# Altium schematic sheet POE.SchDoc: {Наименование}
size 420 x 297 mm; ApprovedBy: {Утвердил}; CheckedBy: {Проверил}; DrawnBy: {Разраб.}; DocumentNumber: АБВГ 123456.789 00; SheetNumber: 12; SheetTotal: {}; Scale: {Мш.}; PageSetup: Record=PageOptions|CenterHorizontal=False|CenterVertical=False|PrintScale=0.95|XCorrection=0.00|YCorrection=0.00|PrintKind=1|BorderSize=5000000|LeftOffset=0|BottomOffset=0|Orientation=1|PaperLength=1000|PaperWidth=1000|Scale=100|PaperSource=15|PrintQuality=600|MediaType=1|DitherType=10|PaperKind=A4|PrintScaleMode=1; ProcessInspection: {Т.контр.}; Mass: {М.}; NormInspection: {Н.контр.}; Letter1Column: {}; Letter2Column: {}; Letter3Column: {}; DocumentType: {Документ}; Rule: PcbType=ProtelPcb
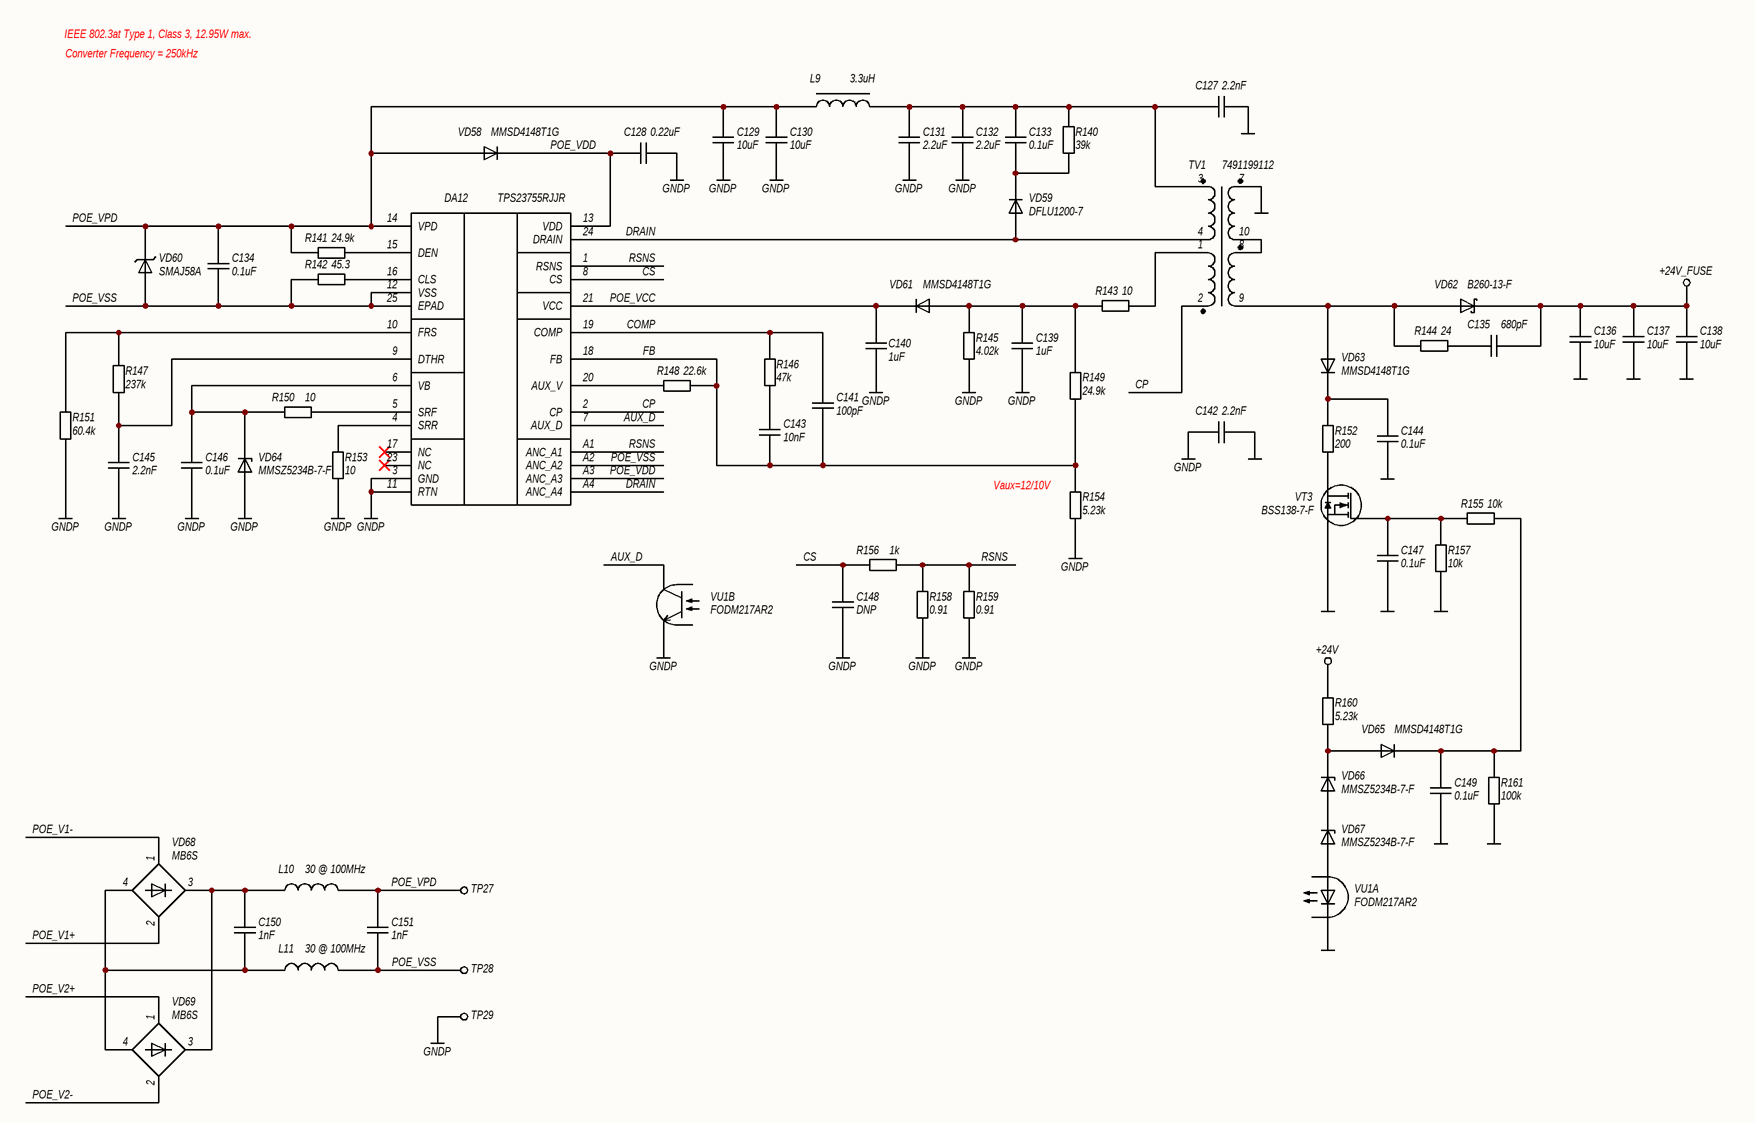
[diagram p0: POE.SchDoc]

## Parts
C127  2.2nF  [C1812N]
C128  0.22uF  [C0805N]
C129  10uF  [C1210N]
C130  10uF  [C1210N]
C131  2.2uF  [C1210N]
C132  2.2uF  [C1210N]
C133  0.1uF  [C0805N]
C134  0.1uF  [C0805N]
C135  680pF  [C0805N]
C136  10uF  [C1206N]
C137  10uF  [C1206N]
C138  10uF  [C1206N]
C139  1uF  [C0805N]
C140  1uF  [C0805N]
C141  100pF  [C0603N]
C142  2.2nF  [C1812N]
C143  10nF  [C0603N]
C144  0.1uF  [C0603N]
C145  2.2nF  [C0603N]
C146  0.1uF  [C0603N]
C147  0.1uF  [C0603N]
C148  DNP  [C0603N]  (no BOM)
C149  0.1uF  [C0603N]
C150  1nF  [C0603N]
C151  1nF  [C0603N]
DA12  TPS23755RJJR  [RJJ0023B (VSON-24 EP)]
L9  3.3uH  [SRN3015]
L10  30 @ 100MHz  [FB0603N]
L11  30 @ 100MHz  [FB0603N]
R140  39k  [R0805N]
R141  24.9k  [R0603N]
R142  45.3  [R0603N]
R143  10  [R0805N]
R144  24  [R1206N]
R145  4.02k  [R0603N]
R146  47k  [R0603N]
R147  237k  [R0603N]
R148  22.6k  [R0603N]
R149  24.9k  [R0603N]
R150  10  [R0603N]
R151  60.4k  [R0603N]
R152  200  [R2512N]
R153  10  [R0603N]
R154  5.23k  [R0603N]
R155  10k  [R0603N]
R156  1k  [R0603N]
R157  10k  [R0603N]
R158  0.91  [R1206N]
R159  0.91  [R1206N]
R160  5.23k  [R0603N]
R161  100k  [R0603N]
TP27  TEST_POINT  [TP_RPAD_0.8MM]  (value not drawn)  (no BOM)
TP28  TEST_POINT  [TP_RPAD_0.8MM]  (value not drawn)  (no BOM)
TP29  TEST_POINT  [TP_RPAD_0.8MM]  (value not drawn)  (no BOM)
TV1  7491199112  [7491199112]
VD58  MMSD4148T1G  [SOD123]
VD59  DFLU1200-7  [PowerDI123]
VD60  SMAJ58A  [SMA]
VD61  MMSD4148T1G  [SOD123]
VD62  B260-13-F  [SMB]
VD63  MMSD4148T1G  [SOD123]
VD64  MMSZ5234B-7-F  [SOD123]
VD65  MMSD4148T1G  [SOD123]
VD66  MMSZ5234B-7-F  [SOD123]
VD67  MMSZ5234B-7-F  [SOD123]
VD68  MB6S  [MBS (TO-269AA)]
VD69  MB6S  [MBS (TO-269AA)]
VT3  BSS138-7-F  [SOT23]
VU1  FODM217AR2  [MFP4 2.5x4.4]  (parts A,B of 2)

## Nets
+24V: R160.2
+24V_FUSE: C135.2 C136.2 C137.2 C138.2 VD62.1(K)
GND: C127.2 C136.1 C137.1 C138.1 C142.2 C144.2 C147.1 C149.1 R157.2 R161.2 TV1.7 VT3.2(S) VU1.2(K)
GNDP: C128.1 C129.1 C130.1 C131.1 C132.1 C139.1 C140.1 C142.1 C145.1 C146.2 C148.2 DA12.3(GND) DA12.11(RTN) R145.1 R151.1 R153.1 R154.1 R158.1 R159.1 TP29.1 VD64.2(A) VU1.3(E)
AUX_D: DA12.7(AUX_D) VU1.4(C)
COMP: C141.1 DA12.19(COMP) R146.1
CP: DA12.2(CP) TV1.2
CS: C148.1 DA12.8(CS) R156.2
DRAIN: DA12.24(DRAIN) DA12.A4(ANC_A4) TV1.4 VD59.2(A)
FB: C141.2 C143.2 DA12.18(FB) R148.1 R149.1 R154.2
POE_V1+: VD68.2(AC)
POE_V1-: VD68.1(AC)
POE_V2+: VD69.1(AC)
POE_V2-: VD69.2(AC)
POE_VCC: C140.2 DA12.21(VCC) VD61.1(K)
POE_VDD: C128.2 DA12.13(VDD) DA12.A3(ANC_A3) VD58.1(K)
POE_VPD: C129.2 C130.2 C134.2 C151.1 DA12.14(VPD) L9.1 L10.2 R141.1 TP27.1 VD58.2(A) VD60.1(K)
POE_VSS: C134.1 C151.2 DA12.12(VSS) DA12.25(EPAD) DA12.A2(ANC_A2) L11.2 R142.1 TP28.1 VD60.2(A)
RSNS: DA12.1(RSNS) DA12.A1(ANC_A1) R156.1 R158.2 R159.2
NetC127_1: C127.1 C131.2 C132.2 C133.2 L9.2 R140.2 TV1.3
NetC133_1: C133.1 R140.1 VD59.1(K)
NetC135_1: C135.1 R144.1
NetC139_2: C139.2 R143.1 R145.2 R149.2 VD61.2(A)
NetC143_1: C143.1 R146.2
NetC144_1: C144.1 R152.2 VD63.1(K)
NetC145_2: C145.2 DA12.9(DTHR) R147.2
NetC146_1: C146.1 DA12.6(VB) R150.1 VD64.1(K)
NetC147_2: C147.2 R155.1 R157.1 VT3.1(G)
NetC149_2: C149.2 R155.2 R161.1 VD65.1(K)
NetC150_1: C150.1 L10.1 VD68.3(+) VD69.3(+)
NetC150_2: C150.2 L11.1 VD68.4(-) VD69.4(-)
NetDA12_4: DA12.4(SRR) R153.2
NetDA12_5: DA12.5(SRF) R150.2
NetDA12_10: DA12.10(FRS) R147.1 R151.2
NetDA12_15: DA12.15(DEN) R141.2
NetDA12_16: DA12.16(CLS) R142.2
NetDA12_20: DA12.20(AUX_V) R148.2
NetR143_2: R143.2 TV1.1
NetR144_2: R144.2 TV1.9 VD62.2(A) VD63.2(A)
NetR152_1: R152.1 VT3.3(D)
NetR160_1: R160.1 VD65.2(A) VD66.1(K)
NetTV1_8: TV1.8 TV1.10
NetVD66_2: VD66.2(A) VD67.1(K)
NetVD67_2: VD67.2(A) VU1.1(A)

Not connected (* = marked no-connect by the designer): DA12 17(NC)* 23(NC)*

## Notes on the sheet
- IEEE 802.3at Type 1, Class 3, 12.95W max.
- Converter Frequency = 250kHz
- (near R154) Vaux=12/10V
- Подп. и дата
- Инв. № дубл.
- Взам. инв. №
- Инв. № подл.
- Лист
- Изм.
- № докум.
- Подп.
- Дата
- Копировал
- Формат А3

## Library data of the parts
C127 C142 = GR443QR73D222KW01L: Конденсатор; Точность: 10%; Напряжение: 2kV; Диэлектрик: X7R; Производитель: Murata Electronics; Описание: 2200 pF ±10% 2000V (2kV) Ceramic Capacitor X7R 1812 (4532 Metric); Корпус: 1812 (4532 Metric); Температурный диапазон: -55°C ~ 125°C; Вид монтажа: SMD; Артикул: GR443QR73D222KW01L; Номинал: 2.2nF; Строка для документации: https://search.murata.co.jp/Ceramy/image/img/A01X/G101/ENG/GR443QR73D222KW01-01.pdf; Тип элемента: Конденсатор
C128 = CC0805KKX7R0BB224: Конденсатор; Точность: 10%; Напряжение: 100V; Диэлектрик: X7R; Производитель: YAGEO; Описание: 0.22 µF ±10% 100V Ceramic Capacitor X7R 0805 (2012 Metric); Корпус: 0805 (2012 Metric); Температурный диапазон: -55°C ~ 125°C; Вид монтажа: SMD; Артикул: CC0805KKX7R0BB224; Номинал: 0.22uF; Строка для документации: https://www.yageo.com/upload/media/product/app/datasheet/mlcc/upy-np0x7r_mv_100-to-630v.pdf; Тип элемента: Конденсатор
C129 C130 = GRM32EC72A106KE05L: Конденсатор; Точность: 10%; Напряжение: 100V; Диэлектрик: X7S; Производитель: Murata Electronics; Описание: 10 µF ±10% 100V Ceramic Capacitor X7S 1210 (3225 Metric); Корпус: 1210 (3225 Metric); Температурный диапазон: -55°C ~ 125°C; Вид монтажа: SMD; Артикул: GRM32EC72A106KE05L; Номинал: 10uF; Строка для документации: https://www.samsungsem.com/resources/file/global/support/product_catalog/MLCC.pdf; Тип элемента: Конденсатор
C131 C132 = CL32B225KCJSNNE: Конденсатор; Точность: 10%; Напряжение: 100V; Диэлектрик: X7R; Производитель: Samsung Electro-Mechanics; Описание: 2.2 µF ±10% 100V Ceramic Capacitor X7R 1210 (3225 Metric); Корпус: 1210 (3225 Metric); Температурный диапазон: -55°C ~ 125°C; Вид монтажа: SMD; Артикул: CL32B225KCJSNNE; Номинал: 2.2uF; Строка для документации: https://mm.digikey.com/Volume0/opasdata/d220001/medias/docus/41/CL32B225KCJSNNE_Spec.pdf; Тип элемента: Конденсатор
C133 C134 = CL21B104KCFNNNE: Конденсатор; Точность: 10%; Напряжение: 100V; Диэлектрик: X7R; Производитель: Samsung Electro-Mechanics; Описание: 0.1 µF ±10% 100V Ceramic Capacitor X7R 0805 (2012 Metric); Корпус: 0805 (2012 Metric); Температурный диапазон: -55°C ~ 125°C; Вид монтажа: SMD; Артикул: CL21B104KCFNNNE; Номинал: 0.1uF; Строка для документации: https://mm.digikey.com/Volume0/opasdata/d220001/medias/docus/893/CL21B104KCFNNNE_Spec.pdf; Тип элемента: Конденсатор
C135 = CC0805KRX7R0BB681: Конденсатор; Точность: 10%; Напряжение: 100V; Диэлектрик: X7R; Производитель: YAGEO; Описание: 680 pF ±10% 100V Ceramic Capacitor X7R 0805 (2012 Metric); Корпус: 0805 (2012 Metric); Температурный диапазон: -55°C ~ 125°C; Вид монтажа: SMD; Артикул: CC0805KRX7R0BB681; Номинал: 680pF; Строка для документации: https://www.yageo.com/upload/media/product/app/datasheet/mlcc/upy-np0x7r_mv_100-to-630v.pdf; Тип элемента: Конденсатор
C136-C138 = CL31B106KBHNNNE: Конденсатор; Точность: 10%; Напряжение: 50V; Диэлектрик: X7R; Производитель: Samsung Electro-Mechanics; Описание: 10 µF ±10% 50V Ceramic Capacitor X7R 1206 (3216 Metric); Корпус: 1206 (3216 Metric); Температурный диапазон: -55°C ~ 125°C; Вид монтажа: SMD; Артикул: CL31B106KBHNNNE; Номинал: 10uF; Строка для документации: https://mm.digikey.com/Volume0/opasdata/d220001/medias/docus/41/CL31B106KBHNNNE_Spec.pdf; Тип элемента: Конденсатор
C139 C140 = CL21B105KAFNNNE: Конденсатор; Точность: 10%; Напряжение: 25V; Диэлектрик: X7R; Производитель: Samsung Electro-Mechanics; Описание: 1 µF ±10% 25V Ceramic Capacitor X7R 0805 (2012 Metric); Корпус: 0805 (2012 Metric); Температурный диапазон: -55°C ~ 125°C; Вид монтажа: SMD; Артикул: CL21B105KAFNNNE; Номинал: 1uF; Строка для документации: https://mm.digikey.com/Volume0/opasdata/d220001/medias/docus/1105/CL21B105KAFNNNE_Spec.pdf; Тип элемента: Конденсатор
C141 = CL10C101JB8NNNC: Конденсатор; Точность: 5%; Напряжение: 50V; Диэлектрик: NP0; Производитель: Samsung Electro-Mechanics; Описание: 100 pF ±5% 50V Ceramic Capacitor C0G, NP0 0603 (1608 Metric); Корпус: 0603 (1608 Metric); Температурный диапазон: -55°C ~ 125°C; Вид монтажа: SMD; Артикул: CL10C101JB8NNNC; Номинал: 100pF; Строка для документации: https://mm.digikey.com/Volume0/opasdata/d220001/medias/docus/609/CL10C101JB8NNNC_Spec.pdf; Тип элемента: Конденсатор
C143 = CL10B103KB8NNNC: Конденсатор; Точность: 10%; Напряжение: 16V; Диэлектрик: X7R; Производитель: Samsung Electro-Mechanics; Описание: 10000 pF ±10% 50V Ceramic Capacitor X7R 0603 (1608 Metric); Корпус: 0603 (1608 Metric); Температурный диапазон: -55°C ~ 125°C; Вид монтажа: SMD; Артикул: CL10B103KB8NNNC; Номинал: 10nF; Строка для документации: https://mm.digikey.com/Volume0/opasdata/d220001/medias/docus/609/CL10B103KB8NNNC_Spec.pdf; Тип элемента: Конденсатор
C144 C146 C147 C149 = CL10B104KB8NNNC: Конденсатор; Точность: 10%; Напряжение: 50V; Диэлектрик: X7R; Производитель: Samsung Electro-Mechanics; Описание: 0.1 µF ±10% 50V Ceramic Capacitor X7R 0603 (1608 Metric); Корпус: 0603 (1608 Metric); Температурный диапазон: -55°C ~ 125°C; Вид монтажа: SMD; Артикул: CL10B104KB8NNNC; Номинал: 0.1uF; Строка для документации: https://mm.digikey.com/Volume0/opasdata/d220001/medias/docus/609/CL10B104KB8NNNC_Spec.pdf; Тип элемента: Конденсатор
C145 = CL10B222KB8NNNC: Конденсатор; Точность: 10%; Напряжение: 50V; Диэлектрик: X7R; Производитель: Samsung Electro-Mechanics; Описание: 2200 pF ±10% 50V Ceramic Capacitor X7R 0603 (1608 Metric); Корпус: 0603 (1608 Metric); Температурный диапазон: -55°C ~ 125°C; Вид монтажа: SMD; Артикул: CL10B222KB8NNNC; Номинал: 2.2nF; Строка для документации: https://mm.digikey.com/Volume0/opasdata/d220001/medias/docus/1832/CL10B222KB8NNNC_Spec.pdf; Тип элемента: Конденсатор
C148 = CC0603CRNPO9BN6R8: Конденсатор; Корпус: 0603 (1608 Metric); Вид монтажа: SMD; Артикул: *; Номинал: DNP; Точность: *; Напряжение: *; Диэлектрик: *; Производитель: *; Описание: *; Строка для документации: *; Температурный диапазон: *; Тип элемента: Конденсатор
C150 C151 = CL10B102KC8NNNC: Конденсатор; Точность: 10%; Напряжение: 100V; Диэлектрик: X7R; Производитель: Samsung Electro-Mechanics; Описание: 1000 pF ±10% 100V Ceramic Capacitor X7R 0603 (1608 Metric); Корпус: 0603 (1608 Metric); Температурный диапазон: -55°C ~ 125°C; Вид монтажа: SMD; Артикул: CL10B102KC8NNNC; Номинал: 1nF; Строка для документации: https://mm.digikey.com/Volume0/opasdata/d220001/medias/docus/1136/CL10B102KC8NNNC_Spec.pdf; Тип элемента: Конденсатор
DA12 = TPS23755RJJR: Микросхема PoE 802.3at DC-DC контроллера; Производитель: Texas Instruments; Описание: Power Over Ethernet Controller 1 Channel 802.3at (PoE) 24-VSON (6x4); Корпус: 24-VFDFN Exposed Pad, 23 Leads; Температурный диапазон: -40°C ~ 125°C (TJ); Вид монтажа: SMD; Артикул: TPS23755RJJR; Строка для документации: https://www.ti.com/lit/ds/symlink/tps23755.pdf; Тип элемента: Микросхема
L9 = SRN3015-3R3M: Дроссель с магнитопроводом; Точность: 20%; Ток номинальный: 1.6A; Ток насыщения: 1.4A; Сопротивление: 112m; Производитель: Bourns Inc.; Описание: 3.3 µH Semi-Shielded Drum Core, Wirewound Inductor 1.6 A 112mOhm Max Nonstandard; Корпус: 3.00mm x 3.00mm; Температурный диапазон: -40°C ~ 125°C; Вид монтажа: SMD; Артикул: SRN3015-3R3M; Номинал: 3.3uH; Строка для документации: https://www.bourns.com/docs/Product-Datasheets/SRN3015.pdf; Тип элемента: Дроссель
L10 L11 = BLM18PG300SN1D: Фильтр ЭМП индуктивный; Ток: 1A; Сопротивление: 50m; Тип: Ferrite Bead; Производитель: Murata Electronics; Описание: 30 Ohms @ 100 MHz 1 Power Line Ferrite Bead 0603 (1608 Metric) 1A 50mOhm; Корпус: 0603 (1608 Metric); Температурный диапазон: -55°C ~ 125°C; Вид монтажа: SMD; Артикул: BLM18PG300SN1D; Номинал: 30 @ 100MHz; Строка для документации: https://www.murata.com/en-us/products/productdata/8796738650142/ENFA0003.pdf; Тип элемента: Фильтр ЭМП
R140 = RC0805JR-0739KL: Резистор; Точность: 5%; ТКС: ±100ppm/°C; Напряжение: 150V; Производитель: YAGEO; Описание: 39 kOhms ±5% 0.125W, 1/8W Chip Resistor 0805 (2012 Metric) Moisture Resistant Thick Film; Корпус: 0805 (2012 Metric); Температурный диапазон: -55°C ~ 155°C; Вид монтажа: SMD; Артикул: RC0805JR-0739KL; Номинал: 39k; Строка для документации: https://www.yageo.com/upload/media/product/productsearch/datasheet/rchip/PYu-RC_Group_51_RoHS_L_12.pdf; Тип элемента: Резистор
R141 R149 = RC0603FR-0724K9L: Резистор; Точность: 1%; ТКС: ±100ppm/°C; Напряжение: 75V; Производитель: YAGEO; Описание: 24.9 kOhms ±1% 0.1W, 1/10W Chip Resistor 0603 (1608 Metric) Moisture Resistant Thick Film; Корпус: 0603 (1608 Metric); Температурный диапазон: -55°C ~ 155°C; Вид монтажа: SMD; Артикул: RC0603FR-0724K9L; Номинал: 24.9k; Строка для документации: https://www.yageo.com/upload/media/product/app/datasheet/rchip/pyu-rc_group_51_rohs_l.pdf; Тип элемента: Резистор
R142 = RC0603FR-0745R3L: Резистор; Точность: 1%; ТКС: ±100ppm/°C; Напряжение: 75V; Производитель: YAGEO; Описание: 45.3 Ohms ±1% 0.1W, 1/10W Chip Resistor 0603 (1608 Metric) Moisture Resistant Thick Film; Корпус: 0603 (1608 Metric); Температурный диапазон: -55°C ~ 155°C; Вид монтажа: SMD; Артикул: RC0603FR-0745R3L; Номинал: 45.3; Строка для документации: https://www.yageo.com/upload/media/product/app/datasheet/rchip/pyu-rc_group_51_rohs_l.pdf; Тип элемента: Резистор
R143 = RC0805FR-0710RL: Резистор; Точность: 1%; ТКС: ±100ppm/°C; Напряжение: 150V; Производитель: YAGEO; Описание: 10 Ohms ±1% 0.125W, 1/8W Chip Resistor 0805 (2012 Metric) Moisture Resistant Thick Film; Корпус: 0805 (2012 Metric); Температурный диапазон: -55°C ~ 155°C; Вид монтажа: SMD; Артикул: RC0805FR-0710RL; Номинал: 10; Строка для документации: https://www.yageo.com/upload/media/product/productsearch/datasheet/rchip/PYu-RC_Group_51_RoHS_L_12.pdf; Тип элемента: Резистор
R144 = RC1206JR-0724RL: Резистор; Точность: 5%; ТКС: ±100ppm/°C; Напряжение: 75V; Производитель: YAGEO; Описание: 24 Ohms ±5% 0.1W, 1/10W Chip Resistor 0603 (1608 Metric) Moisture Resistant Thick Film; Корпус: 1206 (3216 Metric); Температурный диапазон: -55°C ~ 155°C; Вид монтажа: SMD; Артикул: RC1206JR-0724RL; Номинал: 24; Строка для документации: https://www.yageo.com/upload/media/product/productsearch/datasheet/rchip/PYu-RC_Group_51_RoHS_L_12.pdf; Тип элемента: Резистор
R145 = RC0603FR-074K02L: Резистор; Точность: 1%; ТКС: ±100ppm/°C; Напряжение: 75V; Производитель: YAGEO; Описание: 4.02 kOhms ±1% 0.1W, 1/10W Chip Resistor 0603 (1608 Metric) Moisture Resistant Thick Film; Корпус: 0603 (1608 Metric); Температурный диапазон: -55°C ~ 155°C; Вид монтажа: SMD; Артикул: RC0603FR-074K02L; Номинал: 4.02k; Строка для документации: https://www.yageo.com/upload/media/product/app/datasheet/rchip/pyu-rc_group_51_rohs_l.pdf; Тип элемента: Резистор
R146 = RC0603FR-0747KL: Резистор; Точность: 1%; ТКС: ±100ppm/°C; Напряжение: 75V; Производитель: YAGEO; Описание: 47 kOhms ±1% 0.1W, 1/10W Chip Resistor 0603 (1608 Metric) Moisture Resistant Thick Film; Корпус: 0603 (1608 Metric); Температурный диапазон: -55°C ~ 155°C; Вид монтажа: SMD; Артикул: RC0603FR-0747KL; Номинал: 47k; Строка для документации: https://www.yageo.com/upload/media/product/app/datasheet/rchip/pyu-rc_group_51_rohs_l.pdf; Тип элемента: Резистор
R147 = RC0603FR-07237KL: Резистор; Точность: 1%; ТКС: ±100ppm/°C; Напряжение: 75V; Производитель: YAGEO; Описание: 237 kOhms ±1% 0.1W, 1/10W Chip Resistor 0603 (1608 Metric) Moisture Resistant Thick Film; Корпус: 0603 (1608 Metric); Температурный диапазон: -55°C ~ 155°C; Вид монтажа: SMD; Артикул: RC0603FR-07237KL; Номинал: 237k; Строка для документации: https://www.yageo.com/upload/media/product/app/datasheet/rchip/pyu-rc_group_51_rohs_l.pdf; Тип элемента: Резистор
R148 = RC0603FR-0722K6L: Резистор; Точность: 1%; ТКС: ±100ppm/°C; Напряжение: 75V; Производитель: YAGEO; Описание: 22.6 kOhms ±1% 0.1W, 1/10W Chip Resistor 0603 (1608 Metric) Moisture Resistant Thick Film; Корпус: 0603 (1608 Metric); Температурный диапазон: -55°C ~ 155°C; Вид монтажа: SMD; Артикул: RC0603FR-0722K6L; Номинал: 22.6k; Строка для документации: https://www.yageo.com/upload/media/product/app/datasheet/rchip/pyu-rc_group_51_rohs_l.pdf; Тип элемента: Резистор
R150 R153 = RC0603FR-0710RL: Резистор; Точность: 1%; ТКС: ±100ppm/°C; Напряжение: 75V; Производитель: YAGEO; Описание: 10 Ohms ±1% 0.1W, 1/10W Chip Resistor 0603 (1608 Metric) Moisture Resistant Thick Film; Корпус: 0603 (1608 Metric); Температурный диапазон: -55°C ~ 155°C; Вид монтажа: SMD; Артикул: RC0603FR-0710RL; Номинал: 10; Строка для документации: https://www.yageo.com/upload/media/product/app/datasheet/rchip/pyu-rc_group_51_rohs_l.pdf; Тип элемента: Резистор
R151 = RC0603FR-0760K4L: Резистор; Точность: 1%; ТКС: ±100ppm/°C; Напряжение: 75V; Производитель: YAGEO; Описание: 60.4 kOhms ±1% 0.1W, 1/10W Chip Resistor 0603 (1608 Metric) Moisture Resistant Thick Film; Корпус: 0603 (1608 Metric); Температурный диапазон: -55°C ~ 155°C; Вид монтажа: SMD; Артикул: RC0603FR-0760K4L; Номинал: 60.4k; Строка для документации: https://www.yageo.com/upload/media/product/app/datasheet/rchip/pyu-rc_group_51_rohs_l.pdf; Тип элемента: Резистор
R152 = CR2512-JW-201ELF: Резистор; Точность: 5%; ТКС: ±200ppm/°C; Напряжение: 200V; Производитель: Bourns Inc.; Описание: 200 Ohms ±5% 1W Chip Resistor 2512 (6432 Metric) Thick Film; Корпус: 2512 (6432 Metric); Температурный диапазон: -55°C ~ 155°C; Вид монтажа: SMD; Артикул: CR2512-JW-201ELF; Номинал: 200; Строка для документации: https://www.bourns.com/docs/product-datasheets/cr.pdf; Тип элемента: Резистор
R154 R160 = RC0603FR-075K23L: Резистор; Точность: 1%; ТКС: ±100ppm/°C; Напряжение: 75V; Производитель: YAGEO; Описание: 5.23 kOhms ±1% 0.1W, 1/10W Chip Resistor 0603 (1608 Metric) Moisture Resistant Thick Film; Корпус: 0603 (1608 Metric); Температурный диапазон: -55°C ~ 155°C; Вид монтажа: SMD; Артикул: RC0603FR-075K23L; Номинал: 5.23k; Строка для документации: https://www.yageo.com/upload/media/product/app/datasheet/rchip/pyu-rc_group_51_rohs_l.pdf; Тип элемента: Резистор
R155 R157 = RC0603FR-0710KL: Резистор; Точность: 1%; ТКС: ±100ppm/°C; Напряжение: 75V; Производитель: YAGEO; Описание: 10 kOhms ±1% 0.1W, 1/10W Chip Resistor 0603 (1608 Metric) Moisture Resistant Thick Film; Корпус: 0603 (1608 Metric); Температурный диапазон: -55°C ~ 155°C; Вид монтажа: SMD; Артикул: RC0603FR-0710KL; Номинал: 10k; Строка для документации: https://www.yageo.com/upload/media/product/app/datasheet/rchip/pyu-rc_group_51_rohs_l.pdf; Тип элемента: Резистор
R156 = RC0603FR-071KL: Резистор; Точность: 1%; ТКС: ±100ppm/°C; Напряжение: 75V; Производитель: YAGEO; Описание: 1 kOhms ±1% 0.1W, 1/10W Chip Resistor 0603 (1608 Metric) Moisture Resistant Thick Film; Корпус: 0603 (1608 Metric); Температурный диапазон: -55°C ~ 155°C; Вид монтажа: SMD; Артикул: RC0603FR-071KL; Номинал: 1k; Строка для документации: https://www.yageo.com/upload/media/product/app/datasheet/rchip/pyu-rc_group_51_rohs_l.pdf; Тип элемента: Резистор
R158 R159 = RL1206FR-070R91L: Резистор; Точность: 1%; ТКС: ±200ppm/°C; Производитель: YAGEO; Описание: 910 mOhms ±1% 0.25W, 1/4W Chip Resistor 1206 (3216 Metric) Automotive AEC-Q200, Current Sense, Moisture Resistant Thick Film; Корпус: 1206 (3216 Metric); Температурный диапазон: -55°C ~ 155°C; Вид монтажа: SMD; Артикул: RL1206FR-070R91L; Номинал: 0.91; Строка для документации: https://www.yageo.com/upload/media/product/app/datasheet/rchip/pyu-rl_group_521_rohs_l.pdf; Тип элемента: Резистор
R161 = RC0603FR-07100KL: Резистор; Точность: 1%; ТКС: ±100ppm/°C; Напряжение: 75V; Производитель: YAGEO; Описание: 100 kOhms ±1% 0.1W, 1/10W Chip Resistor 0603 (1608 Metric) Moisture Resistant Thick Film; Корпус: 0603 (1608 Metric); Температурный диапазон: -55°C ~ 155°C; Вид монтажа: SMD; Артикул: RC0603FR-07100KL; Номинал: 100k; Строка для документации: https://www.yageo.com/upload/media/product/app/datasheet/rchip/pyu-rc_group_51_rohs_l.pdf; Тип элемента: Резистор
TP27-TP29 = Test Point, Round Pad, 0.8mm diameter: Контрольная точка; Количество контактов: 1; Тип элемента: Разъем; Артикул: Test Point, Round Pad, 0.8mm diameter; Тип разъема: Test Point; Описание: Test Point, Round Pad, 0.8mm diameter
TV1 = 7491199112: Трансформатор PoE; Производитель: Würth Elektronik; Описание: Power Over Ethernet (PoE) For For DC/DC Converters SMPS Transformer 1500Vrms Isolation Surface Mount; Корпус: 13.46mm x 15.00mm; Температурный диапазон: -40°C ~ 125°C; Вид монтажа: SMD; Артикул: 7491199112; Назначение: PoE; Строка для документации: https://www.we-online.com/katalog/datasheet/7491199112.pdf; Тип элемента: Трансформатор
VD58 VD61 VD63 VD65 = MMSD4148T1G: Диод; Прямой ток: 200mA; Напряжение: 100V; Тип: Standard; Производитель: onsemi; Описание: Diode 100 V 200mA Surface Mount SOD-123; Корпус: SOD-123; Температурный диапазон: -55°C ~ 150°C; Вид монтажа: SMD; Артикул: MMSD4148T1G; Строка для документации: https://www.onsemi.com/pdf/datasheet/mmsd4148t1-d.pdf; Тип элемента: Диод
VD59 = DFLU1200-7: Диод; Прямой ток: 1A; Напряжение: 200V; Тип: Standard; Производитель: Diodes Incorporated; Описание: Diode 200 V 1A Surface Mount PowerDI™ 123; Корпус: PowerDI™ 123; Температурный диапазон: -65°C ~ 150°C; Вид монтажа: SMD; Артикул: DFLU1200-7; Строка для документации: https://www.diodes.com/assets/Datasheets/ds30601.pdf; Тип элемента: Диод
VD60 = SMAJ58A: TVS диод однонаправлвенный; Напряжение: 58V; Напряжение ограничения: 93.6V; Напряжение пробоя: 64.4V; Ток: 4.3A; Тип: TVS Unidirectional; Производитель: Littelfuse Inc.; Описание: 93.6V Clamp 4.3A Ipp Tvs Diode Surface Mount DO-214AC (SMA); Корпус: DO-214AC, SMA; Температурный диапазон: -65°C ~ 150°C (TJ); Вид монтажа: SMD; Тип элемента: Диод защитный; Артикул: SMAJ58A; Строка для документации: https://www.littelfuse.com/~/media/electronics/datasheets/tvs_diodes/littelfuse_tvs_diode_smaj_datasheet.pdf.pdf
VD62 = B260-13-F: Диод Шоттки; Прямой ток: 2A; Напряжение: 60V; Производитель: Diodes Incorporated; Описание: Diode 60 V 2A Surface Mount SMB; Корпус: DO-214AA, SMB; Температурный диапазон: -65°C ~ 150°C; Вид монтажа: SMD; Артикул: B260-13-F; Тип: Schottky; Строка для документации: https://www.diodes.com/assets/Datasheets/B220_A-B260_A.pdf; Тип элемента: Диод
VD64 VD66 VD67 = MMSZ5234B-7-F: Стабилитрон; Прямой ток: 20mA; Напряжение: 6.2V; Производитель: Diodes Incorporated; Описание: Zener Diode 6.2 V 500 mW ±5% Surface Mount SOD-123; Корпус: SOD-123; Температурный диапазон: -65°C ~ 150°C; Вид монтажа: SMD; Тип элемента: Диод; Артикул: MMSZ5234B-7-F; Тип: Zener; Строка для документации: https://www.diodes.com/assets/Datasheets/ds18010.pdf
VD68 VD69 = MB6S: Диодный мост, однофазный; Прямой ток: 500mA; Напряжение: 600V; Тип: Standard; Производитель: Diotec Semiconductor; Описание: Bridge Rectifier Single Phase Standard 600 V Surface Mount TO-269AA MINIDIL SLIM; Корпус: TO-269AA, 4-BESOP; Температурный диапазон: -50°C ~ 150°C (TJ); Вид монтажа: SMD; Тип элемента: Диод; Артикул: MB6S; Строка для документации: https://diotec.com/tl_files/diotec/files/pdf/datasheets/mb2s.pdf
VT3 = BSS138-7-F: МОП транзистор, N-канальный; Ток: 200mA; Напряжение: 50V; Сопротивление канала: 3.5; Пороговое напряжение: 1.5V; Тип: N-MOSFET; Производитель: Diodes Incorporated; Описание: N-Channel 50 V 200mA (Ta) 300mW (Ta) Surface Mount SOT-23-3; Корпус: SOT-23-3; Температурный диапазон: -55°C ~ 150°C (TJ); Вид монтажа: SMD; Тип элемента: Транзистор полевой; Артикул: BSS138-7-F; Строка для документации: https://www.diodes.com/assets/Datasheets/BSS138.pdf
VU1 = FODM217AR2: NPN транзисторная оптопара; Прямой ток: 50mA; Напряжение: 1.2V; Производитель: onsemi; Описание: Optoisolator Transistor Output 3750Vrms 1 Channel 4-SOP; Корпус: 4-SOIC (0.173", 4.40mm Width); Температурный диапазон: -55°C ~ 110°C; Вид монтажа: SMD; Артикул: FODM217AR2; Строка для документации: https://www.onsemi.com/pdf/datasheet/fodm214-d.pdf; Тип элемента: Транзисторная оптопара